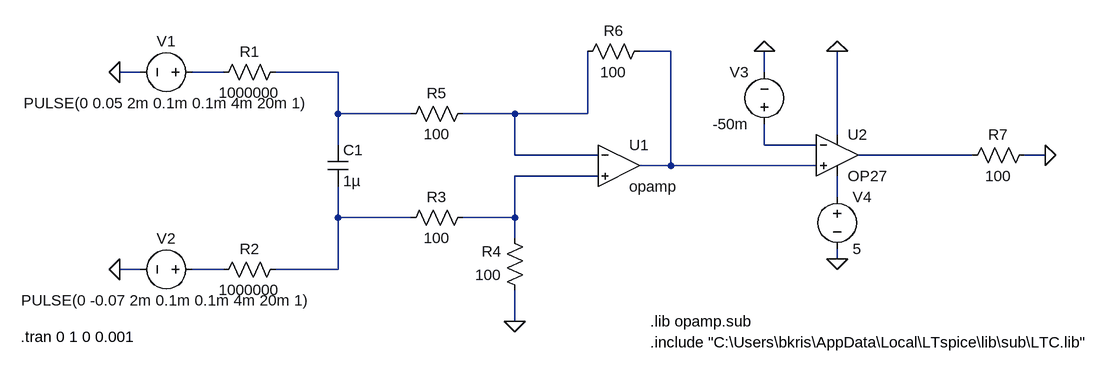
[diagram p0: schematic ECNANuero.asc]
ECNANuero.asc, the LTspice schematic file:
Version 4
SHEET 1 1908 816
WIRE 1168 352 1120 352
WIRE 352 384 320 384
WIRE 480 384 432 384
WIRE 656 384 560 384
WIRE 1312 384 1312 352
WIRE 656 448 656 384
WIRE 768 448 656 448
WIRE 928 448 848 448
WIRE 1040 448 1040 352
WIRE 1040 448 928 448
WIRE 1424 480 1424 352
WIRE 656 496 656 448
WIRE 1312 496 1312 464
WIRE 1392 496 1312 496
WIRE 928 512 928 448
WIRE 1056 512 928 512
WIRE 1632 512 1456 512
WIRE 1744 512 1712 512
WIRE 1168 528 1168 352
WIRE 1168 528 1120 528
WIRE 1392 528 1168 528
WIRE 1056 544 928 544
WIRE 1424 576 1424 544
WIRE 656 608 656 560
WIRE 768 608 656 608
WIRE 928 608 928 544
WIRE 928 608 848 608
WIRE 928 640 928 608
WIRE 1424 672 1424 656
WIRE 352 688 320 688
WIRE 480 688 432 688
WIRE 656 688 656 608
WIRE 656 688 560 688
WIRE 928 768 928 720
FLAG 320 688 0
FLAG 320 384 0
FLAG 928 768 0
FLAG 1312 352 0
FLAG 1424 672 0
FLAG 1424 352 0
FLAG 1744 512 0
SYMBOL voltage 448 384 R90
WINDOW 0 -32 56 VBottom 2
WINDOW 3 32 56 VTop 2
WINDOW 123 0 0 Left 0
WINDOW 39 0 0 Left 0
SYMATTR InstName V1
SYMATTR Value PULSE(0 0.05 2m 0.1m 0.1m 4m 20m 1)
SYMBOL voltage 448 688 R90
WINDOW 0 -32 56 VBottom 2
WINDOW 3 32 56 VTop 2
WINDOW 123 0 0 Left 0
WINDOW 39 0 0 Left 0
SYMATTR InstName V2
SYMATTR Value PULSE(0 -0.07 2m 0.1m 0.1m 4m 20m 1)
SYMBOL res 576 368 R90
WINDOW 0 0 56 VBottom 2
WINDOW 3 32 56 VTop 2
SYMATTR InstName R1
SYMATTR Value 1000000
SYMBOL res 576 672 R90
WINDOW 0 0 56 VBottom 2
WINDOW 3 32 56 VTop 2
SYMATTR InstName R2
SYMATTR Value 1000000
SYMBOL cap 640 496 R0
SYMATTR InstName C1
SYMATTR Value 1µ
SYMBOL res 864 592 R90
WINDOW 0 0 56 VBottom 2
WINDOW 3 32 56 VTop 2
SYMATTR InstName R3
SYMATTR Value 100
SYMBOL res 944 736 R180
WINDOW 0 36 76 Left 2
WINDOW 3 36 40 Left 2
SYMATTR InstName R4
SYMATTR Value 100
SYMBOL res 864 432 R90
WINDOW 0 0 56 VBottom 2
WINDOW 3 32 56 VTop 2
SYMATTR InstName R5
SYMATTR Value 100
SYMBOL OpAmps\\opamp 1088 464 R0
SYMATTR InstName U1
SYMBOL res 1136 336 R90
WINDOW 0 0 56 VBottom 2
WINDOW 3 32 56 VTop 2
SYMATTR InstName R6
SYMATTR Value 100
SYMBOL voltage 1312 480 R180
WINDOW 0 24 96 Left 2
WINDOW 3 24 16 Left 2
WINDOW 123 0 0 Left 0
WINDOW 39 0 0 Left 0
SYMATTR InstName V3
SYMATTR Value -50m
SYMBOL voltage 1424 560 R0
WINDOW 123 0 0 Left 0
WINDOW 39 0 0 Left 0
SYMATTR InstName V4
SYMATTR Value 5
SYMBOL res 1728 496 R90
WINDOW 0 0 56 VBottom 2
WINDOW 3 32 56 VTop 2
SYMATTR InstName R7
SYMATTR Value 100
SYMBOL OpAmps\\OP27 1424 448 R0
SYMATTR InstName U2
TEXT 168 792 Left 2 !.tran 0 1 0 0.001
TEXT 1136 768 Left 2 !.lib opamp.sub
TEXT 1136 800 Left 2 !.include "C:\\Users\\bkris\\AppData\\Local\\LTspice\\lib\\sub\\LTC.lib"

The netlist it stands for:
* ECNANuero.asc
V1 N002 0 PULSE(0 0.05 2m 0.1m 0.1m 4m 20m 1)
V2 N010 0 PULSE(0 -0.07 2m 0.1m 0.1m 4m 20m 1)
R1 N003 N002 1000000
R2 N009 N010 1000000
C1 N003 N009 1µ
R3 N007 N009 100
R4 0 N007 100
R5 N004 N003 100
XU1 N004 N007 N001 opamp Aol=100K GBW=10Meg  ; pins invin noninvin out
R6 N001 N004 100
V3 N005 0 -50m
V4 N008 0 5
R7 0 N006 100
XU2 N001 N005 0 N008 N006 OP27  ; pins In+ In- V+ V- OUT
.tran 0 1 0 0.001
.lib opamp.sub
.include "C:\Users\bkris\AppData\Local\LTspice\lib\sub\LTC.lib"
.lib ADI.lib
.backanno
.end